# Altium schematic sheet LCD.SchDoc
size B; SheetNumber: 7; SheetTotal: 7
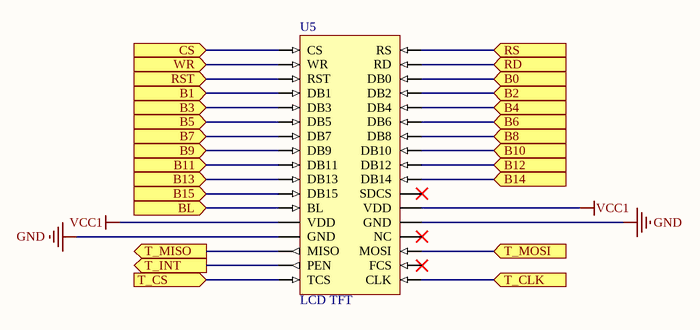
[diagram p0: LCD.SchDoc]

## Parts
U5  LCD TFT  [LCD TFT 2.8" Parallel 8/16-bit]

## Ports
B0 (in), B1 (in), B2 (in), B3 (in), B4 (in), B5 (in), B6 (in), B7 (in), B8 (in), B9 (in), B10 (in), B11 (in), B12 (in), B13 (in), B14 (in), B15 (in), BL (in), CS (in), RD (in), RS (in), RST (in), T_CLK (in), T_CS (in), T_INT (out), T_MISO (out), T_MOSI (in), WR (in)

## Nets
GND: U5.14(GND) U5.22(GND)
VCC1: U5.13(VDD) U5.23(VDD)
B0: U5.32(DB0) ; port B0
B1: U5.4(DB1) ; port B1
B2: U5.31(DB2) ; port B2
B3: U5.5(DB3) ; port B3
B4: U5.30(DB4) ; port B4
B5: U5.6(DB5) ; port B5
B6: U5.29(DB6) ; port B6
B7: U5.7(DB7) ; port B7
B8: U5.28(DB8) ; port B8
B9: U5.8(DB9) ; port B9
B10: U5.27(DB10) ; port B10
B11: U5.9(DB11) ; port B11
B12: U5.26(DB12) ; port B12
B13: U5.10(DB13) ; port B13
B14: U5.25(DB14) ; port B14
B15: U5.11(DB15) ; port B15
BL: U5.12(BL) ; port BL
CS: U5.1(CS) ; port CS
RD: U5.33(RD) ; port RD
RS: U5.34(RS) ; port RS
RST: U5.3(RST) ; port RST
T_CLK: U5.18(CLK) ; port T_CLK
T_CS: U5.17(TCS) ; port T_CS
T_INT: U5.16(PEN) ; port T_INT
T_MISO: U5.15(MISO) ; port T_MISO
T_MOSI: U5.20(MOSI) ; port T_MOSI
WR: U5.2(WR) ; port WR

Not connected (* = marked no-connect by the designer): U5 19(FCS)* 21(NC)* 24(SDCS)*

## Notes on the sheet
- DWG. NO.
- REV.
- SHT.
- THIS DOCUMENT AND THE DATA DISCLOSED HEREIN OR HEREWITH IS THE PROPERTY OF ALTIUM LIMITED AND MAY BE FREELY DISTRIBUTED IN WHOLE. NO RIGHTS ARE RESERVED OR EXPRESS OR IMPLIED WARANTEE GIVEN.
- REVISION
- DESCRIPTION
- DATE
- APPROVED
- ENG:
- APPROVALS
- PROJECT
- DSN:
- CHK:
- REFERENCE DOCUMENTS
- PROJECT REVISION:
- TITLE
- DOCUMENT REVISION:
- DESIGN ITEM:
- BOM:
- FAB DWG:
- PCB DWG:
- ASSY DWG:
- SCALE:
- SIZE
- B
- CAGE CODE
- FILE NAME
- DWG NO.
- SHEET
- OF
- REV

## Library data of the parts
U5 = LCD TFT 16-bit